# EAGLE design sprite (EAGLE 6.6.0)
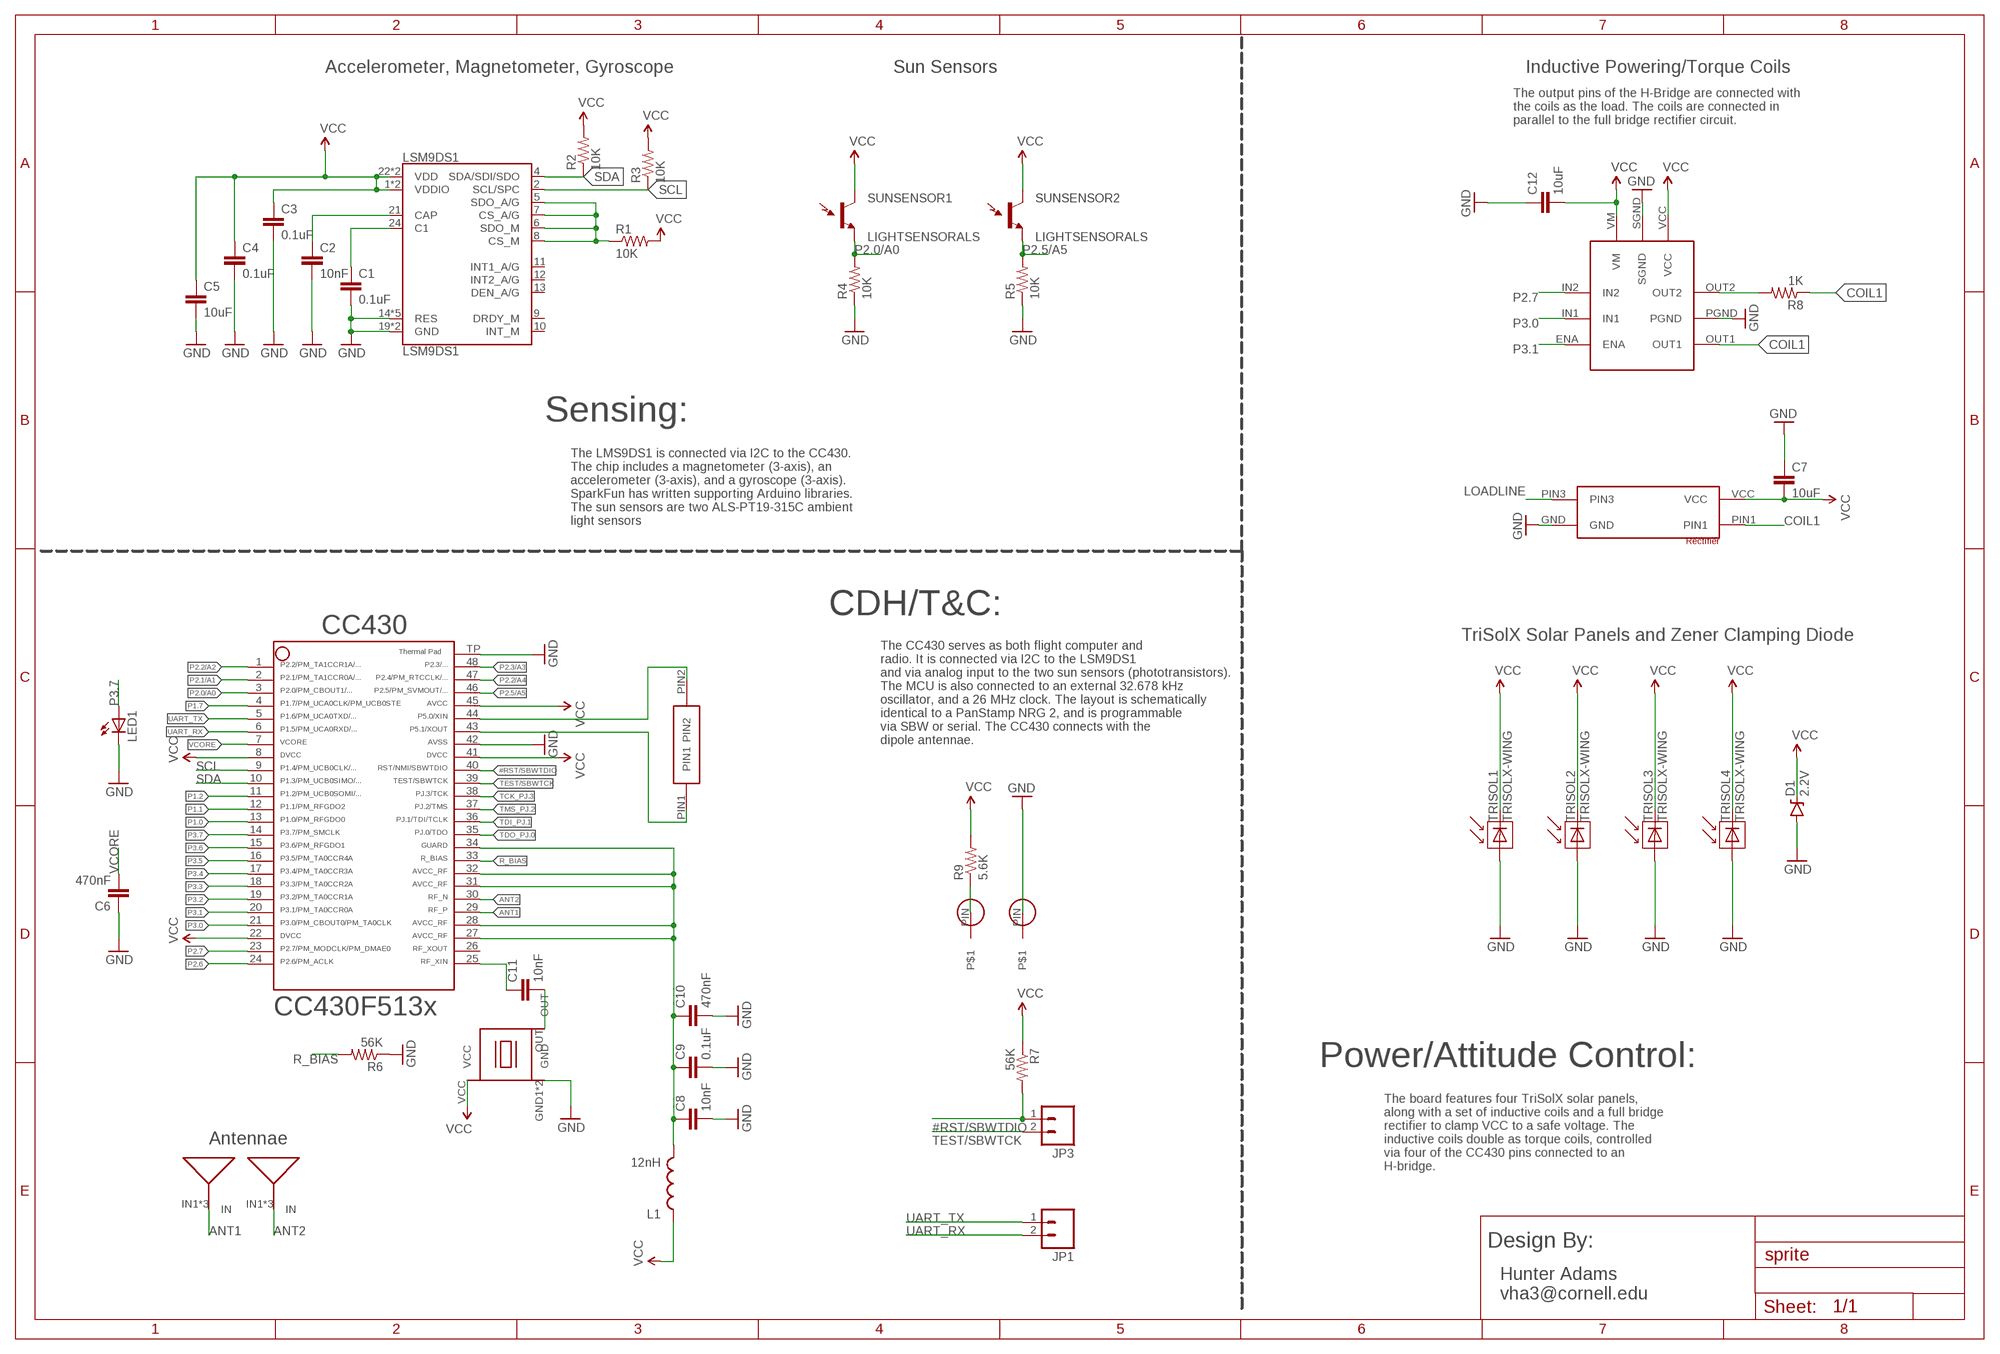
[diagram p0: schematic, sheet 1]

## Parts
32KHZ  SPRITECRYSTALSPRITECRYSTAL  [SPRITECRYSTAL]
ANTENNA1  ANTENNA  [ANTENNA]
ANTENNA2  ANTENNA  [ANTENNA]
C1  0.1uF  CAP0805  [0805]
C2  10nF  CAP0805  [0805]
C3  0.1uF  CAP0805  [0805]
C4  0.1uF  CAP0805  [0805]
C5  10uF  CAP0805  [0805]
C6  470nF  CAP0805  [0805]
C7  10uF  CAP0805  [0805]
C8  10nF  CAP0805  [0805]
C9  0.1uF  CAP0805  [0805]
C10  470nF  CAP0805  [0805]
C11  10nF  CAP0805  [0805]
C12  10uF  CAP0805  [0805]
CC430  CC430F513X---RGZ48  [RGZ48]
D1  2.2V  DIODE-ZENER3.3V  [SOD-323]
GNDPIN  SPRITE_PIN  [SPRITE_PIN]
H-BRIDGE  LV8417CS  [LV8417CS]
JP1  M02PTH  [1X02]
JP3  M02PTH  [1X02]
L1  12nH  INDUCTOR0402  [C0402]
LED1  LED0603  [LED-0603]
LSM9DS1  LSM9DS1  [LGA24-8X4]
R1  10K  RESISTOR0805-RES  [0805]
R2  10K  RESISTOR0805-RES  [0805]
R3  10K  RESISTOR0805-RES  [0805]
R4  10K  RESISTOR0805-RES  [0805]
R5  10K  RESISTOR0805-RES  [0805]
R6  56K  RESISTOR0805-RES  [0805]
R7  56K  RESISTOR0805-RES  [0805]
R8  1K  RESISTOR0805-RES  [0805]
R9  5.6K  RESISTOR0805-RES  [0805]
RECTIFIER  NSR1030QMUTAG  [NSR1030QMUTAG]
SUNSENSOR1  LIGHTSENSORALS  [ALS-PT19]
SUNSENSOR2  LIGHTSENSORALS  [ALS-PT19]
TRISOL1  TRISOLX-WING  [TRISOLX-T01]
TRISOL2  TRISOLX-WING  [TRISOLX-T01]
TRISOL3  TRISOLX-WING  [TRISOLX-T01]
TRISOL4  TRISOLX-WING  [TRISOLX-T01]
TXCO  TCXO_7Z  [TXC_7Z]
VCCPIN  SPRITE_PIN  [SPRITE_PIN]

## Nets
#RST/SBWTDIO: CC430.40 JP3.1 R7.2
ANT1: ANTENNA1.IN1(IN) ANTENNA1.IN2(IN) ANTENNA1.IN3(IN) CC430.29
ANT2: ANTENNA2.IN1(IN) ANTENNA2.IN2(IN) ANTENNA2.IN3(IN) CC430.30
COIL1: H-BRIDGE.OUT1 R8.1 RECTIFIER.PIN1
GND: C1.2 C2.2 C3.2 C4.2 C5.2 C6.1 C7.1 C8.2 C9.2 C10.2 C12.1 CC430.42 CC430.TP D1.A GNDPIN.PIN H-BRIDGE.PGND H-BRIDGE.SGND LED1.C LSM9DS1.14(RES) LSM9DS1.15(RES) LSM9DS1.16(RES) LSM9DS1.17(RES) LSM9DS1.18(RES) LSM9DS1.19(GND) LSM9DS1.20(GND) R4.1 R5.1 R6.1 RECTIFIER.GND TRISOL1.P$3(A) TRISOL2.P$3(A) TRISOL3.P$3(A) TRISOL4.P$3(A) TXCO.GND1(GND) TXCO.GND2(GND)
GUARD: C8.1 C9.1 C10.1 CC430.27 CC430.28 CC430.31 CC430.32 CC430.34 L1.2
LOADLINE: H-BRIDGE.OUT2 R8.2 RECTIFIER.PIN3
N$1: C1.1 LSM9DS1.24(C1)
N$2: C2.1 LSM9DS1.21(CAP)
N$3: LSM9DS1.5(SDO_A/G) LSM9DS1.6(SDO_M) LSM9DS1.7(CS_A/G) LSM9DS1.8(CS_M) R1.1
N$4: C11.1 CC430.25
N$5: C11.2 TXCO.OUT
N$6: R9.1 VCCPIN.PIN
N$7: 32KHZ.PIN2 CC430.44
N$8: 32KHZ.PIN1 CC430.43
P1.0: CC430.13
P1.1: CC430.12
P1.2: CC430.11
P1.7: CC430.4
P2.0/A0: CC430.3 R4.2 SUNSENSOR1.E(E1)
P2.1/A1: CC430.2
P2.2/A2: CC430.1
P2.2/A4: CC430.47
P2.3/A3: CC430.48
P2.5/A5: CC430.46 R5.2 SUNSENSOR2.E(E1)
P2.6: CC430.24
P2.7: CC430.23 H-BRIDGE.IN2
P3.0: CC430.21 H-BRIDGE.IN1
P3.1: CC430.20 H-BRIDGE.ENA
P3.2: CC430.19
P3.3: CC430.18
P3.4: CC430.17
P3.5: CC430.16
P3.6: CC430.15
P3.7: CC430.14 LED1.A
R_BIAS: CC430.33 R6.2
SCL: CC430.9 LSM9DS1.2(SCL/SPC) R3.1
SDA: CC430.10 LSM9DS1.4(SDA/SDI/SDO) R2.1
TCK_PJ.3: CC430.38
TDI_PJ.1: CC430.36
TDO_PJ.0: CC430.35
TEST/SBWTCK: CC430.39 JP3.2
TMS_PJ.2: CC430.37
UART_RX: CC430.6 JP1.2
UART_TX: CC430.5 JP1.1
VCC: C3.1 C4.1 C5.1 C7.2 C12.2 CC430.8 CC430.22 CC430.41 CC430.45 D1.C H-BRIDGE.VCC H-BRIDGE.VM L1.1 LSM9DS1.1(VDDIO) LSM9DS1.3(VDDIO) LSM9DS1.22(VDD) LSM9DS1.23(VDD) R1.2 R2.2 R3.2 R7.1 R9.2 RECTIFIER.VCC SUNSENSOR1.C(C1) SUNSENSOR2.C(C1) TRISOL1.P$2(C) TRISOL2.P$2(C) TRISOL3.P$2(C) TRISOL4.P$2(C) TXCO.VCC
VCORE: C6.2 CC430.7
Unconnected: CC430.26 LSM9DS1.9(DRDY_M) LSM9DS1.10(INT_M) LSM9DS1.11(INT1_A/G) LSM9DS1.12(INT2_A/G) LSM9DS1.13(DEN_A/G)

## Notes on the sheet
- Accelerometer, Magnetometer, Gyroscope | Sun Sensors | Inductive Powering/Torque Coils
- The output pins of the H-Bridge are connected with
  the coils as the load. The coils are connected in 
  parallel to the full bridge rectifier circuit.
- Sensing:
- The LMS9DS1 is connected via I2C to the CC430. 
  The chip includes a magnetometer (3-axis), an 
  accelerometer (3-axis), and a gyroscope (3-axis). 
  SparkFun has written supporting Arduino libraries. 
  The sun sensors are two ALS-PT19-315C ambient 
  light sensors
- CDH/T&C:
- TriSolX Solar Panels and Zener Clamping Diode
- The CC430 serves as both flight computer and
  radio. It is connected via I2C to the LSM9DS1 
  and via analog input to the two sun sensors (phototransistors). 
  The MCU is also connected to an external 32.678 kHz 
  oscillator, and a 26 MHz clock. The layout is schematically 
  identical to a PanStamp NRG 2, and is programmable 
  via SBW or serial. The CC430 connects with the 
  dipole antennae.
- Power/Attitude Control:
- Antennae
- The board features four TriSolX solar panels, 
  along with a set of inductive coils and a full bridge 
  rectifier to clamp VCC to a safe voltage. The 
  inductive coils double as torque coils, controlled 
  via four of the CC430 pins connected to an 
  H-bridge.
- Design By:
- Hunter Adams
  vha3@cornell.edu

## Library data of the parts
32KHZ = SpriteCrystal:SPRITECRYSTAL
ANTENNA1 ANTENNA2 = SpriteAntenna:ANTENNA
C1-C12 = SparkFun:CAP: Capacitor Standard 0603 ceramic capacitor, and 0.1" leaded capacitor.
CC430 = TI_MSP430_v16:CC430F513X---RGZ48: ***CC430F513X***RGZ48 ** ** Rev 1.0 ** 06/2010 * http://focus.ti.com/docs/prod/folders/print/cc430f5137.html
D1 = SparkFun-DiscreteSemi:DIODE-ZENER: Zener Diode Production Part - 8199 3.4V Zener Voltage; PROD_ID: DIO-11284; VALUE: 3.3V
GNDPIN VCCPIN = SpritePin:SPRITE_PIN
H-BRIDGE = lv8417cs:LV8417CS
JP1 JP3 = SparkFun:M02: Header 2 Standard 2-pin 0.1" header. Use with straight break away headers (SKU : PRT-00116), right angle break away headers (PRT-00553), swiss pins (PRT-00743), machine pins (PRT-00117), and female headers (PRT-00115). Molex polarized connector foot print use with SKU : PRT-08233 with associated crimp pins and housings.
L1 = SparkFun:INDUCTOR: Inductors Basic Inductor/Choke - 0603 and 1206. Footprints are not proven and vary greatly between part numbers.
LED1 = SparkFun:LED: LEDs Standard schematic elements and footprints for 5mm, 3mm, 1206, and 0603 sized LEDs. 5mm - Spark Fun Electronics SKU : COM-00529 (and others)
LSM9DS1 = SparkFun-Sensors:LSM9DS1: LSM9DS1 3D accelerometer, gyroscope & magnetometer The LSM9DS1 is a system-in-package featuring a 3D digital linear acceleration sensor, a 3D digital angular rate sensor, and a 3D digital magnetic sensor. The LSM9DS1 has a linear acceleration full scale of ±2g/±4g/±8/±16 g, a magnetic field full scale of ±4/±8/±12/±16 gauss and an angular rate of ±245/±500/±2000 dps. The LSM9DS1 includes an I2 C serial bus interface supporting standard and fast mode (100 kHz and 400 kHz) and an SPI serial standard interface. Magnetic, accelerometer and gyroscope sensing can be enabled or set in power-down mode separately for smart power management. The LSM9DS1 is available in a plastic land grid array package (LGA) and it is guaranteed to operate over an extended temperature range from -40 °C to +85 °C.; PROD_ID: IC-12536
R1-R9 = SparkFun:RESISTOR: Resistor Basic schematic elements and footprints for 0603, 1206, and PTH resistors.
RECTIFIER = NSR1030QMUTAG:NSR1030QMUTAG
SUNSENSOR1 SUNSENSOR2 = SparkFun-Sensors:LIGHTSENSOR: Ambient Light Sensor Simple light detection sensor. Output varies with light intensity input. Spark Fun Electronics SKU : COM-08348; PROD_ID: IC-11836
TRISOL1-TRISOL4 = TriSolX_QzQube:TRISOLX-WING
TXCO = SpriteTCXO:TCXO_7Z

## Board
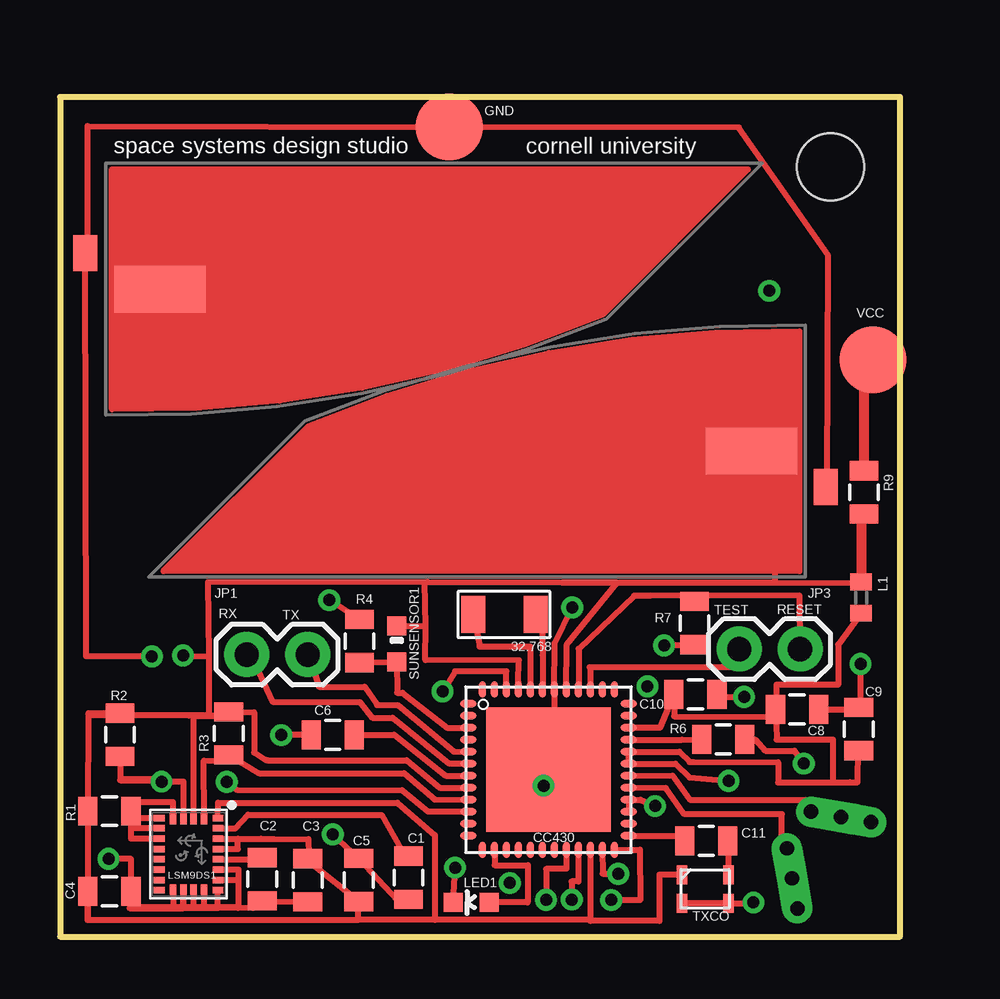
[diagram p1: board, top side]
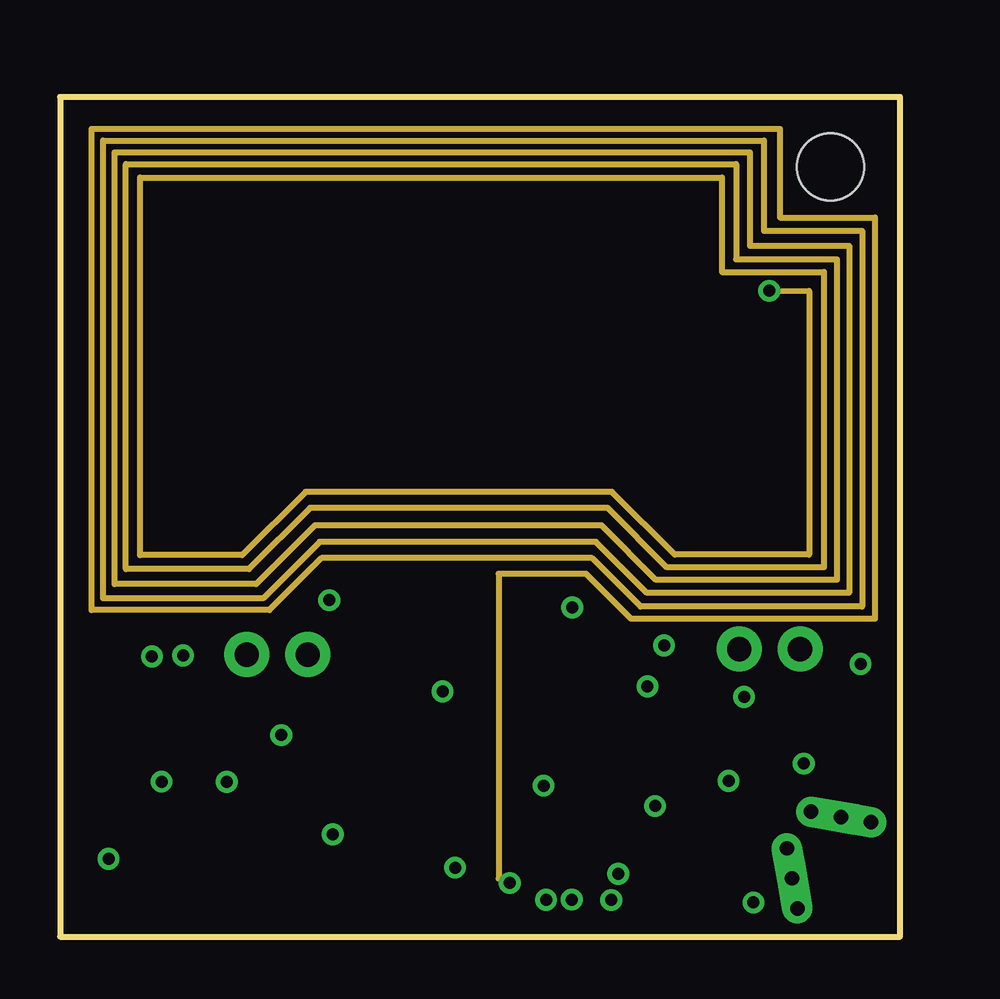
[diagram p2: board, inner layer Route2]
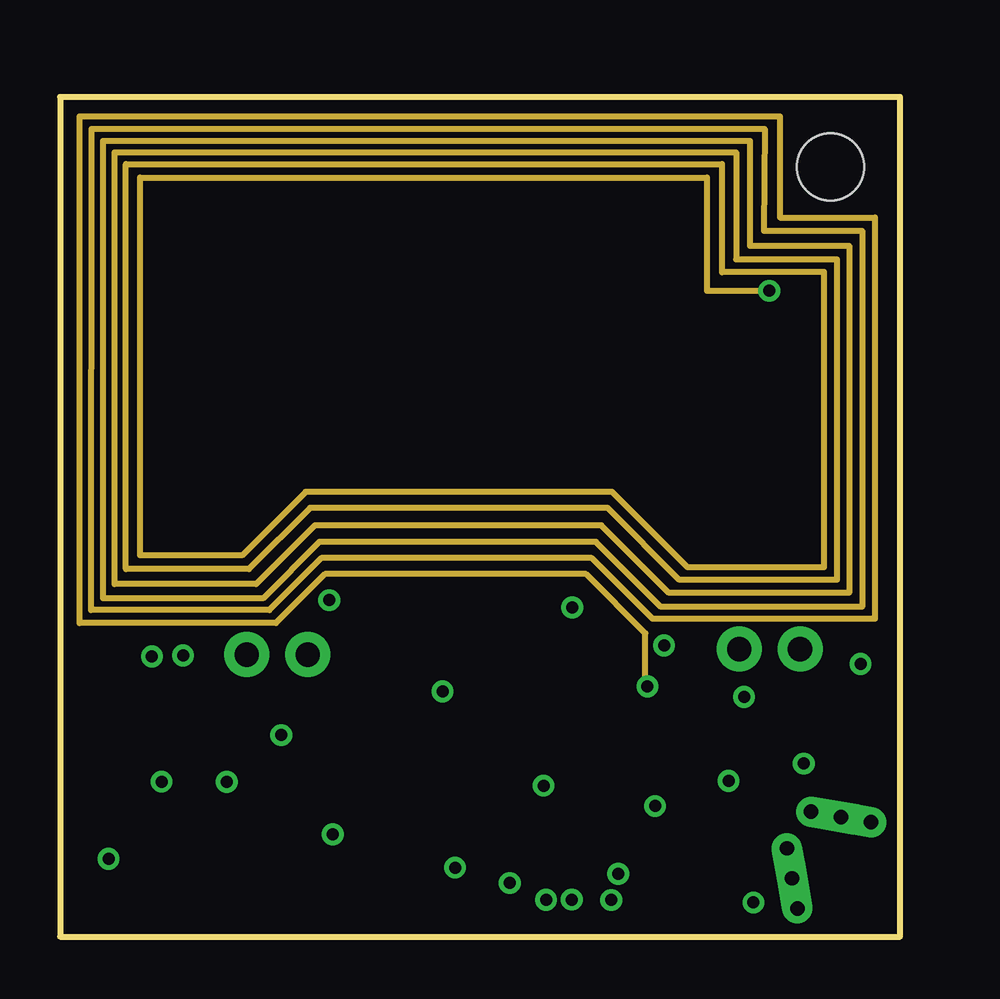
[diagram p3: board, inner layer Route15]
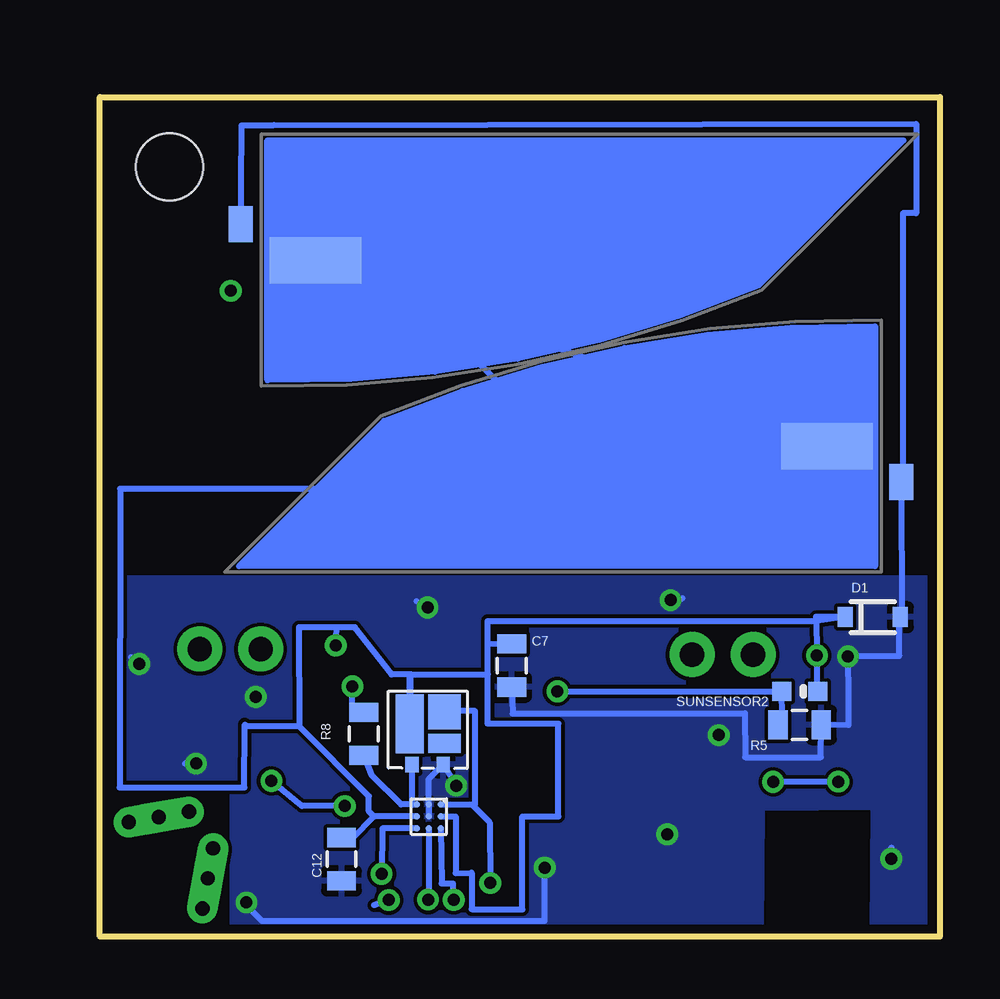
[diagram p4: board, bottom side, seen from below]

Size 35 x 35 mm. Coordinates in mm from the lower left corner, seen from the top.
Outline: 0,0 35,0 35,35 0,35 0,0
Copper layers (1*2*15*16): Top 0.035559375mm / dielectric 1.501140625mm / Route2 0.035559375mm / dielectric 0.149859375mm / Route15 0.035559375mm / dielectric 0.200659375mm / Bottom 0.035559375mm
Design rules "typical_4pcb *": minimum track width 10mil, minimum drill 15mil, track to track 6mil, track to pad 6mil, pad to pad 6mil, via to via 6mil, smd to smd 6mil, copper to edge 15mil, drill to drill 8mil, minimum pad ring 10mil, minimum via ring 8mil, stop-mask expansion 4mil, vias tented up to drill 0mil, thermal gap 10mil
Holes 2.8 mm at 32.1,32.1

### Footprints (pad centres in the part's own frame; a part is rotated, then mirrored left to right if it is on the bottom)
SPRITECRYSTAL = smd 1 x 1.55: PIN1 -1.3,0; PIN2 1.3,0
ANTENNA = drill 0.6 pad 1.27 square: IN1 0,0 | drill 0.6 pad 1.27 offset: IN2 1.27,0; IN3 -1.27,0
0805 = smd 0.8 x 1.2: 1 -0.9,0; 2 0.9,0
RGZ48 = smd 0.7 x 0.3: 1 -3.35,2.75; 2 -3.35,2.25; 3 -3.35,1.75; 4 -3.35,1.25; 5 -3.35,0.75; 6 -3.35,0.25; 7 -3.35,-0.25; 8 -3.35,-0.75; 9 -3.35,-1.25; 10 -3.35,-1.75; 11 -3.35,-2.25; 12 -3.35,-2.75; 25 3.35,-2.75; 26 3.35,-2.25; 27 3.35,-1.75; 28 3.35,-1.25; 29 3.35,-0.75; 30 3.35,-0.25; 31 3.35,0.25; 32 3.35,0.75; 33 3.35,1.25; 34 3.35,1.75; 35 3.35,2.25; 36 3.35,2.75 | smd 0.3 x 0.7: 13 -2.75,-3.35; 14 -2.25,-3.35; 15 -1.75,-3.35; 16 -1.25,-3.35; 17 -0.75,-3.35; 18 -0.25,-3.35; 19 0.25,-3.35; 20 0.75,-3.35; 21 1.25,-3.35; 22 1.75,-3.35; 23 2.25,-3.35; 24 2.75,-3.35; 37 2.75,3.35; 38 2.25,3.35; 39 1.75,3.35; 40 1.25,3.35; 41 0.75,3.35; 42 0.25,3.35; 43 -0.25,3.35; 44 -0.75,3.35; 45 -1.25,3.35; 46 -1.75,3.35; 47 -2.25,3.35; 48 -2.75,3.35 | smd 5.2 x 5.2: TP 0,0
SOD-323 = smd 0.63 x 0.83: A 1.15,0; C -1.15,0
SPRITE_PIN = smd 2.794 x 2.794: PIN 0,0
LV8417CS = smd 0.27 x 0.27: ENA 0.5,-0.5; IN1 0,-0.5; IN2 -0.5,-0.5; OUT1 0.5,0.5; OUT2 -0.5,0.5; PGND 0,0.5; SGND 0,0; VCC 0.5,0; VM -0.5,0
1X02 = drill 1.016 pad 1.88: 1 0,0; 2 2.54,0
C0402 = smd 0.7 x 0.9: 1 -0.65,0; 2 0.65,0
LED-0603 = smd 0.8 x 0.8: A 0,-0.75; C 0,0.75
LGA24-8X4 = smd 0.27 x 0.45: 1 -1.505,1.225; 6 -1.505,-1.225; 7 -1.075,-1.225; 8 -0.645,-1.225; 9 -0.215,-1.225; 10 0.215,-1.225; 11 0.645,-1.225; 12 1.075,-1.225; 13 1.505,-1.225; 18 1.505,1.225; 19 1.075,1.225; 20 0.645,1.225; 21 0.215,1.225; 22 -0.215,1.225; 23 -0.645,1.225; 24 -1.075,1.225 | smd 0.45 x 0.27: 2 -1.475,0.645; 3 -1.475,0.215; 4 -1.475,-0.215; 5 -1.475,-0.645; 14 1.475,-0.645; 15 1.475,-0.215; 16 1.475,0.215; 17 1.475,0.645
NSR1030QMUTAG = smd 0.55 x 0.633: GND -0.65,1.335; PIN3 0.65,1.335 | smd 1.35 x 0.8: P$2 -0.706,0.453 | smd 1.35 x 1.45: PIN1 -0.7,-0.865 | smd 1.15 x 2.45: VCC 0.738,-0.365
ALS-PT19 = smd 0.8 x 0.8: C -0.75,0; E 0.75,0
TRISOLX-T01 = smd 3.81 x 1.93: P$2 -2,5 | smd 1 x 1.5: P$3 1.1,3.5
TXC_7Z = smd 0.44 x 0.79: GND1 -0.97,-0.595; GND2 0.97,-0.595; OUT 0.97,0.595; VCC -0.97,0.595

### Placement (x,y rotation side)
32KHZ  18.52,13.44 180 top
ANTENNA1  30.51,2.44 100 top
ANTENNA2  32.55,5 170 top
C1  14.52,2.47 270 top
C2  8.43,2.4 270 top
C3  10.32,2.36 270 top
C4  2.06,1.9 0 top
C5  12.45,2.37 90 top
C6  11.36,8.41 0 top
C7  17.84,11.31 90 bottom
C8  30.71,9.48 0 top
C9  33.28,8.66 90 top
C10  26.48,10.11 0 top
C11  26.93,4 0 top
C12  24.93,3.23 90 bottom
CC430  20.35,6.97 0 top
D1  2.8,13.33 0 bottom
GNDPIN  16.22,33.76 0 top
H-BRIDGE  21.29,5.02 0 bottom
JP1  10.32,11.77 180 top
JP3  30.84,11.99 180 top
L1  33.38,14.14 270 top
LED1  17.13,1.44 90 top
LSM9DS1  5.36,3.45 270 top
R1  2.06,5.24 180 top
R2  2.5,8.42 90 top
R3  7.03,8.48 90 top
R4  12.48,12.32 270 top
R5  5.85,8.83 180 bottom
R6  27.63,8.22 180 top
R7  26.43,13.08 90 top
R8  24.01,8.46 270 bottom
R9  33.5,18.53 270 top
RECTIFIER  21.35,8.51 180 bottom
SUNSENSOR1  14.04,12.2 270 top
SUNSENSOR2  5.84,10.23 180 bottom
TRISOL1  2.16,31.99 180 top
TRISOL2  30.81,15.24 0 top
TRISOL3  2.7,15.45 0 bottom
TRISOL4  28.03,33.2 180 bottom
TXCO  26.88,2 0 top
VCCPIN  33.87,24.05 0 top

### Tracks (layer width: path | path; a pad name or v marks a point on that pad's centre or on a via)
#RST/SBWTDIO
  Top 0.254: R7.2 25.97,13.98 25.97,14.21 24.61,14.22 24.61,14.21 | CC430.40 21.61,10.32 21.61,12.01 23.92,14.21 24.43,14.21 24.61,14.21 | JP3.1 30.82,14.22 24.61,14.21
ANT1
  Top 0.254: ANTENNA1.IN3 ANTENNA1.IN1 ANTENNA1.IN2 30.08,3.64 30.08,5.11 26.02,5.11 25.24,6.2 23.72,6.2 CC430.29
ANT2
  Top 0.254: ANTENNA2.IN3 ANTENNA2.IN1 ANTENNA2.IN2 31.29,5.7 26.25,5.71 25.52,6.73 CC430.30
COIL1  (via drill 0.5)
  Route2 0.254: v18.74,2.24 18.28,2.43 18.28,15.13 21.92,15.13 23.79,13.26 33.95,13.26 33.95,29.99 30,29.99 30,33.68 1.32,33.68 1.32,13.62 8.72,13.62 10.89,15.79 22.17,15.79 24.2,13.76 33.42,13.76 33.42,29.43 29.33,29.43 29.33,33.19 1.8,33.19 1.8,14.11 8.46,14.11 10.81,16.46 22.33,16.46 24.46,14.34 32.88,14.34 32.88,28.81 28.74,28.81 28.74,32.7 2.27,32.7 2.27,14.7 8.17,14.7 10.62,17.15 22.56,17.15 24.83,14.88 32.37,14.88 32.37,28.24 28.17,28.24 28.17,32.21 2.75,32.21 2.75,15.33 7.87,15.33 10.42,17.88 22.82,17.88 25.29,15.4 31.83,15.4 31.83,27.71 27.57,27.71 27.57,31.65 3.34,31.65 3.34,15.91 7.59,15.91 10.23,18.55 23,18.55 25.62,15.93 | v29.55,26.93 31.21,26.92 31.21,15.93 25.62,15.93 | 25.62,15.93
  Route15 0.254: v24.48,10.44 24.39,10.51 | 24.39,10.51 24.23,10.63 | 24.39,10.51 24.39,12.65 21.92,15.12 | 21.92,15.12 | 21.92,15.12 11.04,15.12 9,13.08 0.82,13.08 0.82,34.21 29.99,34.21 29.99,29.99 33.96,29.99 33.96,13.26 24.69,13.26 22.17,15.78 10.88,15.78 8.72,13.62 1.29,13.62 1.32,33.68 29.36,33.68 29.33,29.43 33.42,29.43 33.42,13.76 25.03,13.76 22.33,16.46 10.81,16.46 8.46,14.11 1.8,14.11 1.8,33.19 28.74,33.19 28.74,28.8 32.88,28.8 32.88,14.34 25.37,14.34 22.56,17.15 10.62,17.15 8.17,14.7 2.27,14.7 2.27,32.7 28.17,32.7 28.17,28.24 32.37,28.24 32.37,14.88 25.81,14.88 22.82,17.88 10.42,17.88 7.87,15.33 2.75,15.33 2.75,32.21 27.58,32.21 27.58,27.72 | 27.58,27.72 27.58,27.69 | 27.58,27.72 31.83,27.72 31.83,15.4 26.15,15.4 23.01,18.55 10.23,18.55 7.59,15.9 3.34,15.9 3.34,31.65 26.95,31.65 26.95,26.93 v29.55,26.93
  Bottom 0.254: H-BRIDGE.OUT1 19.5,5.51 | 19.5,5.51 19.36,5.51 19.36,9.41 20.65,9.41 RECTIFIER.PIN1 | 19.5,5.51 18.77,4.77 v18.74,2.24 | R8.1 24.48,9.24 v24.48,10.44
GND  (via drill 0.5)
  Top 0.254: 6.55,1.97 LSM9DS1.18 6.58,1.2 | 7.42,1.19 8.05,1.2 8.06,1.5 C2.2 8.21,1.48 C3.2 | 7.42,1.19 6.58,1.2 | C1.2 14.08,1.52 C5.2 v11.36,4.27 | C4.2 2.9,1.2 4.69,1.2 | 4.69,1.2 5.14,1.2 LSM9DS1.15 5.13,1.2 5.56,1.2 | C9.2 33.65,9.48 C8.2 33.36,9.48 v33.36,11.37 | 7.43,2.37 7.43,2.8 LSM9DS1.20 7.42,2.8 7.42,1.22 2.96,1.22 2.96,3.25 v2.02,3.25 | 7.43,2.37 7.42,1.19 | LSM9DS1.19 7.43,2.37 | LSM9DS1.14 4.71,1.22 4.69,1.2 | 5.56,1.2 5.99,1.2 | 5.99,1.2 6.58,1.2 | LSM9DS1.16 5.56,1.2 | LSM9DS1.17 5.99,1.2 | TRISOL2.P$3 31.97,18.94 32.01,28.42 28.29,33.73 16.32,33.74 GNDPIN.PIN 1.15,33.8 1.15,28.65 TRISOL1.P$3 1.09,11.69 v3.83,11.69 | v21.35,13.73 20.61,12.23 CC430.42 20.6,9.3 20.59,9.3 CC430.TP 20.35,6.43 20.09,6.17 v20.15,6.3 | LED1.C v16.46,2.88 | C6.1 v9.21,8.41 | R4.1 v11.22,14.04 | C10.2 27.55,10.01 v28.5,10 | R6.1 28.96,8.22 29.39,7.75 30.6,7.75 v30.99,7.22 | 28.93,1.45 v28.89,1.43 28.96,1.4 TXCO.GND2 TXCO.GND1
  Bottom 0.254: C7.1 17.81,9.31 8.13,9.32 8.12,7.49 4.96,7.48 R5.1 3.82,8.81 3.82,10 v3.83,11.69 1.7,11.69 1.71,11.79 1.71,13.41 1.79,13.42 D1.A 1.59,13.24 TRISOL3.P$3 1.36,18.9 1.54,18.67 1.54,30.16 0.99,30.16 0.99,33.89 27.75,33.83 29.1,33.83 29.11,31.3 29.12,29.47 29.22,29.61 TRISOL4.P$3 | H-BRIDGE.SGND H-BRIDGE.PGND 21.29,6.59 RECTIFIER.GND v20.15,6.3 | 16.41,2.92 v16.46,2.88 16.47,0.66 16.62,0.66 28.25,0.66 29.04,1.44 v28.89,1.43 | v11.36,4.27 11.27,4.42 | v9.21,8.41 8.99,8.64 | v11.22,14.04 10.73,14.11 | v2.02,3.25 2.02,3.72 | v21.35,13.73 21.8,13.98 | v28.5,10 28.44,9.85 | v30.99,7.22 31.46,7.22 | v33.36,11.37 33.71,11.66
  pour Bottom: 0.21,14.95 34.8,14.95 34.8,6.09 29.49,6.09 29.49,0.25 7.44,0.21 7.41,5.38 2.78,5.42 2.82,0.12 -0.17,0.14 -0.17,14.97
GUARD  (via drill 0.5)
  Top 0.254: CC430.27 CC430.28 24.2,5.72 v24.8,5.45 | CC430.34 24.99,8.72 C10.1 25.59,9.19 29.86,9.17 | 29.86,9.17 29.86,9.08 C8.1 29.86,8.22 32.2,8.22 32.2,6.45 32.92,6.44 | L1.2 32.42,12.17 32.42,10.51 29.85,10.51 29.84,9.24 29.89,9.03 29.86,9.17 | 32.92,6.44 33.23,6.44 33.24,6.95 C9.1 | 32.92,6.44 29.92,6.44 29.92,7.28 26.4,7.29 26.24,7.29 25.81,7.72 CC430.32 CC430.31 25.64,7.22 26.22,6.64 v27.86,6.5
  Bottom 0.254: 27.78,6.66 v27.86,6.5 26.59,5.45 v24.8,5.45
LOADLINE
  Bottom 0.254: R8.2 23.69,6.75 22.45,5.51 22,5.51 | RECTIFIER.PIN3 22,5.51 | 22,5.51 H-BRIDGE.OUT2
N$1
  Top 0.254: LSM9DS1.24 6.56,4.53 7.3,4.52 7.83,5.09 13.4,5.08 14.22,3.65 14.36,3.37 C1.1
N$2
  Top 0.254: LSM9DS1.21 8,3.22 C2.1
N$3
  Top 0.254: 4.1,4.92 LSM9DS1.6 2.9,4.95 R1.1 | LSM9DS1.8 2.96,4.09 2.96,4.52 | 2.96,4.52 R1.1 | LSM9DS1.7 2.96,4.52 | LSM9DS1.5 4.71,5.61 3.33,5.61 arc90 R1.1
N$4
  Top 0.254: CC430.25 26.03,4.22 C11.1
N$5
  Top 0.254: C11.2 27.85,4 TXCO.OUT
N$6
  Top 0.406: VCCPIN.PIN 33.5,24.05 R9.1
N$7
  Top 0.254: 32KHZ.PIN2 17.49,12.09 19.6,12.09 CC430.44 | CC430.44
N$8
  Top 0.254: 32KHZ.PIN1 19.95,13.28 19.93,13.23 20.07,13.37 20.11,11.73 CC430.43
P2.0/A0
  Top 0.254: CC430.3 16.13,8.71 14.27,10.17 14.04,10.17 SUNSENSOR1.E 13.97,11.43 R4.2
P2.5/A5  (via drill 0.5)
  Top 0.254: CC430.46 18.6,11.06 16.46,11.06 v15.94,10.23
  Bottom 0.254: R5.2 6.58,9.19 SUNSENSOR2.E 6.55,10.23 v15.94,10.23
P2.6  (via drill 0.5)
  Top 0.254: CC430.24 24.17,3.63 24.18,1.53 23.31,1.52 v22.97,1.53
  Bottom 0.254: v22.97,1.53 23.57,1.32
P2.7  (via drill 0.5)
  Top 0.254: CC430.23 22.61,2.63 v23.26,2.63
  Bottom 0.254: 23.4,2.47 v23.26,2.63 23.23,4.51 H-BRIDGE.IN2
P3.0  (via drill 0.5)
  Top 0.254: CC430.21 21.6,2.31 21.32,2.3 v21.33,1.55
  Bottom 0.254: 21.43,1.55 v21.33,1.55 21.29,1.75 H-BRIDGE.IN1
P3.1  (via drill 0.5)
  Top 0.254: CC430.20 21.1,2.84 20.25,2.83 v20.25,1.54
  Bottom 0.254: H-BRIDGE.ENA 20.76,2.22 20.29,2.22 20.29,1.52 20.16,1.54 v20.25,1.54
P3.7
  Top 0.254: CC430.14 18.11,3.62 18.11,2.98 19.49,2.98 19.49,1.45 19.48,1.44 LED1.A
R_BIAS
  Top 0.254: CC430.33 25.91,8.22 R6.2
SCL
  Top 0.254: LSM9DS1.2 6,7.35 6.87,7.33 7.27,7.45 R3.1 8.3,6.82 14.34,6.82 15.61,5.72 CC430.9
SDA  (via drill 0.5)
  Top 0.254: LSM9DS1.4 5.14,6.48 v4.23,6.47 4.18,6.53 2.51,6.53 R2.1 2.51,6.58 4.19,6.58 v4.23,6.47 | v6.95,6.46 7.36,6.13 14.25,6.11 15.32,5.23 CC430.10
  Bottom 0.254: v4.23,6.47 v6.95,6.46
TEST/SBWTCK
  Top 0.254: JP3.2 28.28,11.23 22.07,11.23 22.1,11.18 CC430.39
UART_RX
  Top 0.254: JP1.2 7.89,11.91 8.86,9.79 12.5,9.79 13.02,9.13 13.86,9.13 16.19,7.23 CC430.6
UART_TX
  Top 0.254: JP1.1 10.8,10.42 12.68,10.42 12.69,10.41 13.21,9.66 14.07,9.66 16.4,7.72 16.99,7.71 CC430.5
VCC  (via drill 0.5)
  Top 0.254: 15.3,14.8 20.91,14.76 | 20.91,14.76 29.79,14.76 | 29.79,14.76 33.66,14.76 33.3,14.84 L1.1 | CC430.8 16.98,6.2 15.82,6.21 14.44,7.36 8.64,7.36 8.57,7.38 8.09,7.68 8.09,9.36 R3.2 7.24,9.3 7.25,9.21 5.57,9.23 LSM9DS1.3 5.58,9.22 7.12,9.21 5.38,9.22 2.95,9.22 2.53,9.31 R2.2 1.18,9.31 | 1.15,0.71 R1.2 1.18,9.31 | 1.15,0.71 C4.1 | 15.3,14.8 6.16,14.78 6.2,11.68 | 6.2,11.68 6.2,9.22 1.2,9.22 1.18,9.31 | CC430.41 21.12,12.2 23.23,14.77 20.91,14.76 | SUNSENSOR1.C 15.23,12.95 | 15.23,12.95 15.2,14.77 15.3,14.8 | CC430.45 19.1,10.61 19.12,11.52 15.23,11.54 15.23,12.95 | 1.15,0.71 12.42,0.7 | 12.42,0.7 C5.1 10.5,3.01 C3.1 10.3,3.24 10.36,3.43 10.35,4.07 8.91,4.08 8.37,4.09 7.41,4.08 | LSM9DS1.23 7.41,4.08 | CC430.22 22.1,0.7 | 22.1,0.7 15.62,0.7 | 15.62,0.7 12.42,0.7 | LSM9DS1.1 6.59,5.59 14.05,5.59 15.62,4.24 15.62,0.7 | v5.12,11.73 5.12,11.7 5.13,11.71 6.2,11.68 | 29.79,22.51 29.79,14.76 | LSM9DS1.22 7.41,3.66 7.41,4.08 | TXCO.VCC 24.97,2.59 24.97,0.66 22.1,0.66 22.1,0.7 | R7.1 26.08,12.15 v25.17,12.14
  Top 0.406: TRISOL2.P$2 TRISOL1.P$2 21.21,22.51 29.79,22.51 | R9.2 33.38,17.63 L1.1
  Bottom 0.254: SUNSENSOR2.C v5.12,11.73 5.16,13.34 | 4.14,13.32 5.12,13.16 | 5.12,13.16 5.16,13.34 | D1.C 4.25,13.32 5.16,13.34 | 5.12,13.16 13.68,13.16 18.85,13.16 18.84,12.17 18.84,12.19 | C7.2 18.84,12.19 | 23.56,5.01 H-BRIDGE.VM 23.59,5.01 | 22.1,8.87 RECTIFIER.VCC | H-BRIDGE.VCC 20.18,5.01 20.18,2.65 19.51,2.67 19.51,1.15 18.84,1.14 17.4,1.14 17.4,5.01 15.89,5.01 15.89,8.88 18.84,8.88 18.84,9.42 18.84,10.94 | 18.84,10.94 18.84,12.19 | TRISOL3.P$2 TRISOL4.P$2 22.46,27.17 13.96,18.67 34.16,18.67 34.18,6.22 28.98,6.22 28.95,8.76 | 22.05,8.88 22.05,10.94 18.84,10.94 | 28.95,8.76 28.95,8.85 | 23.59,5.01 23.79,5.22 23.79,5.85 26.7,8.76 | 26.7,8.76 28.95,8.76 | RECTIFIER.VCC 22.09,10.93 22.85,10.93 24.37,12.9 25.13,12.9 | 25.13,12.9 26.71,12.9 26.7,8.76 | RECTIFIER.VCC 22.05,8.88 | 22.05,8.88 22.05,8.86 | v25.17,12.14 25.16,12.45 25.13,12.9 | C12.2 24.47,4.13 23.59,5.01
VCORE
  Top 0.254: C6.2 13.92,8.42 16.08,6.71 17,6.71 CC430.7

### Text on the board
tPlace: GND | space systems design studio | cornell university | VCC | RX | TX | TEST | RESET